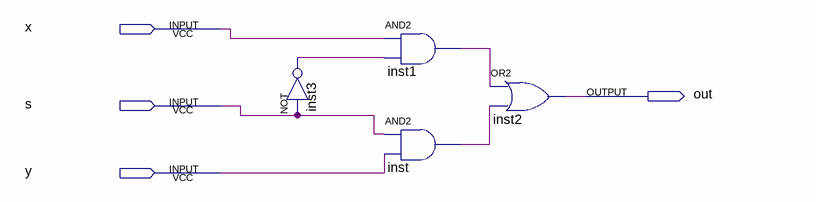
[diagram p0: schematic sheet]
// Quartus schematic 2to1.bdf as structural Verilog: 4 symbols, 4 pins
module \2to1  (
  input  x,
  input  s,
  input  y,
  output out
);

  wire inst1_out, inst3_out, inst_out;

  not inst3 (inst3_out, s);
  and inst1 (inst1_out, x, inst3_out);
  and inst (inst_out, s, y);
  or inst2 (out, inst1_out, inst_out);
endmodule
